# Altium project XRay.PrjPcb
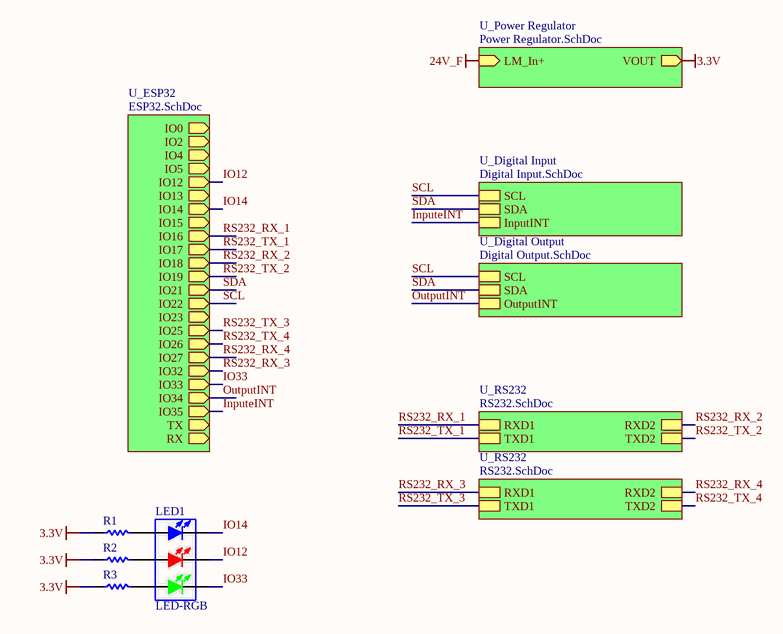
[diagram p0: Main.SchDoc]
6 sheets, 238 parts. Net scope: hierarchical (ports join the sheet entries above them; power ports are global).
Board file: XRay PCB.PcbDoc
Sheets:
  Main.SchDoc
    U_ESP32 = ESP32.SchDoc
    U_Power Regulator = Power Regulator.SchDoc
    U_Digital Output = Digital Output.SchDoc
    U_Digital Input = Digital Input.SchDoc
    U_RS232 = RS232.SchDoc
    U_RS232 = RS232.SchDoc

## Sheet Main.SchDoc
size A4; SheetNumber: 1; SheetTotal: 6

### Parts
LED1  LED-RGB  [LED 3535]
R1  1K  [R 0805]  (value not drawn)
R2  1K  [R 0805]  (value not drawn)
R3  1K  [R 0805]  (value not drawn)

### Sub-sheets
U_Digital Input = Digital Input.SchDoc: SCL, SDA, InputINT
U_Digital Output = Digital Output.SchDoc: SCL, SDA, OutputINT
U_ESP32 = ESP32.SchDoc: IO2 (out), IO4 (out), IO5 (out), IO12 (out), IO13 (out), IO14 (out), IO15 (out), IO16 (out), IO17 (out), IO18 (out), IO19 (out), IO21 (out), IO22 (out), IO23 (out), IO25 (out), IO26 (out), IO27 (out), IO32 (out), IO33 (out), IO34 (out), IO35 (out), IO0 (out), TX (out), RX (out)
U_Power Regulator = Power Regulator.SchDoc: LM_In+ (in), VOUT (out)
U_RS232 = RS232.SchDoc: TXD1, TXD2, RXD1, RXD2
U_RS232 = RS232.SchDoc: TXD1, TXD2, RXD1, RXD2

### Nets
3.3V: R1.1 R2.1 R3.1 ; sheet U_Power Regulator/VOUT  [project net LM_Out+]
InputeINT: sheet U_ESP32/IO35, sheet U_Digital Input/InputINT
IO12: LED1.5(RED_K) ; sheet U_ESP32/IO12
IO14: LED1.6(BULE_K) ; sheet U_ESP32/IO14
IO33: LED1.4(GREEN_K) ; sheet U_ESP32/IO33
OutputINT: sheet U_ESP32/IO34, sheet U_Digital Output/OutputINT
RS232_RX_1: sheet U_ESP32/IO16, sheet U_RS232/RXD1
RS232_RX_2: sheet U_ESP32/IO18, sheet U_RS232/RXD2
RS232_RX_3: sheet U_ESP32/IO32, sheet U_RS232/RXD1
RS232_RX_4: sheet U_ESP32/IO27, sheet U_RS232/RXD2
RS232_TX_1: sheet U_ESP32/IO17, sheet U_RS232/TXD1
RS232_TX_2: sheet U_ESP32/IO19, sheet U_RS232/TXD2
RS232_TX_3: sheet U_ESP32/IO25, sheet U_RS232/TXD1
RS232_TX_4: sheet U_ESP32/IO26, sheet U_RS232/TXD2
SCL: sheet U_ESP32/IO22, sheet U_Digital Output/SCL, sheet U_Digital Input/SCL
SDA: sheet U_ESP32/IO21, sheet U_Digital Output/SDA, sheet U_Digital Input/SDA
NetLED1_1: LED1.1(BULE_A) R1.2
NetLED1_2: LED1.2(RED_A) R2.2
NetLED1_3: LED1.3(GREEN_A) R3.2

### Library data of the parts
LED1 = LED-RGB: Three primary color LED; BOM名称: 三基色LED; 版权归属: 源创客; 学习资源: www.ooocke.com
R1-R3 = R: Chip resistor; 版权归属: 源创客; BOM名称: Chip resistor; 学习资源: www.ooocke.com

## Sheet ESP32.SchDoc
size A4; SheetNumber: 5; SheetTotal: 6
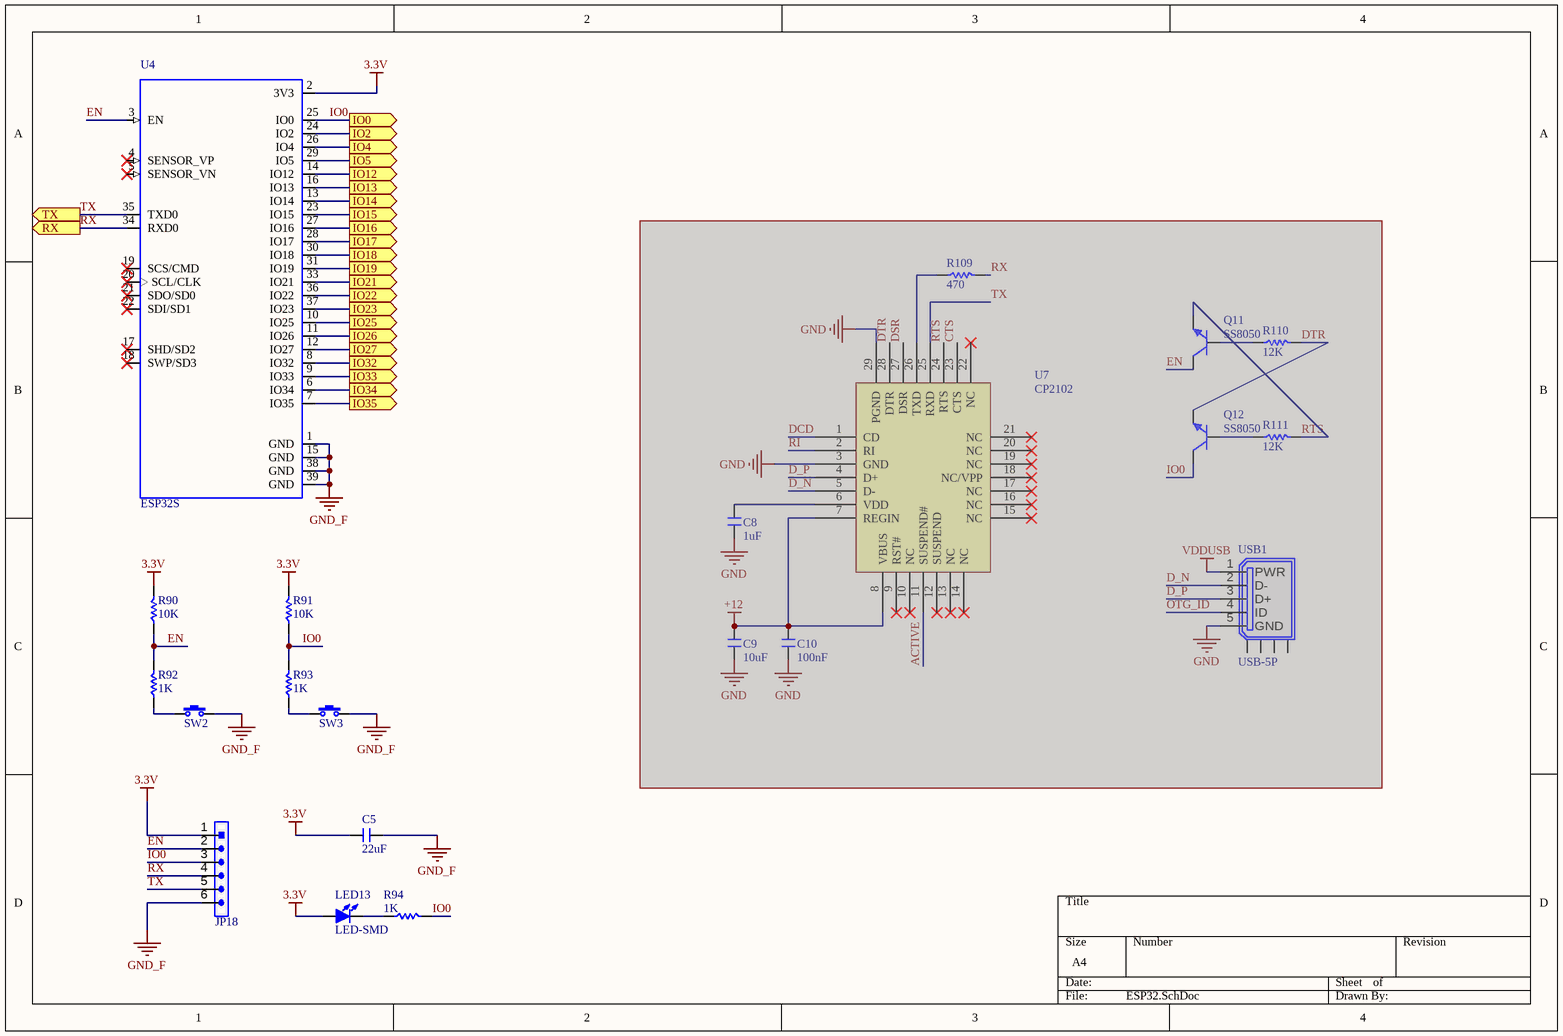
[diagram p1: ESP32.SchDoc]

### Parts
(Parts that share a designator on the sheet are numbered #1, #2 ... from top to bottom, then left to right.)
C5  22uF  [C 0805]
C8  1uF  [C 0805]  (masked out: inside a compile mask, not in the netlist)
C9  10uF  [C 0805]  (masked out: inside a compile mask, not in the netlist)
C10  100nF  [C 0805]  (masked out: inside a compile mask, not in the netlist)
JP18#1  HDR-1X6  [HDR-1X6]  (value not drawn)
LED13  LED-SMD  [LED 0805B]
Q11  SS8050  [SOT23-3N]  (masked out: inside a compile mask, not in the netlist)
Q12  SS8050  [SOT23-3N]  (masked out: inside a compile mask, not in the netlist)
R90  10K  [R 0805]
R91  10K  [R 0805]
R92  1K  [R 0805]
R93  1K  [R 0805]
R94  1K  [R 0805]
R109  470  [R 0805]  (masked out: inside a compile mask, not in the netlist)
R110  12K  [R 0805]  (masked out: inside a compile mask, not in the netlist)
R111  12K  [R 0805]  (masked out: inside a compile mask, not in the netlist)
SW2  3x6x5  [TSW SMD-3*6*2.5]  (value not drawn)
SW3  3x6x5  [TSW SMD-3*6*2.5]  (value not drawn)
U4  ESP32S  [ESP32S]
U7  CP2102  [QFN28]  (masked out: inside a compile mask, not in the netlist)
USB1  USB-5P  [USB-micro_B]  (masked out: inside a compile mask, not in the netlist)

### Ports
IO0 (out), IO2 (out), IO4 (out), IO5 (out), IO12 (out), IO13 (out), IO14 (out), IO15 (out), IO16 (out), IO17 (out), IO18 (out), IO19 (out), IO21 (out), IO22 (out), IO23 (out), IO25 (out), IO26 (out), IO27 (out), IO32 (out), IO33 (out), IO34 (out), IO35 (out), RX (out), TX (out)

### Nets
3.3V: C5.1 JP18#1.1 LED13.1(A) R90.2 R91.2 U4.2(3V3)  [project net LM_Out+]
GND_F: C5.2 JP18#1.6 SW2.2 SW3.2 U4.1(GND) U4.15(GND) U4.38(GND) U4.39(GND)
EN: JP18#1.2 R90.1 R92.2 U4.3(EN)
InputeINT: U4.7(IO35) ; port IO35
IO0: JP18#1.3 R91.1 R93.2 R94.2 U4.25(IO0) ; port IO0
IO12: U4.14(IO12) ; port IO12
IO14: U4.13(IO14) ; port IO14
IO33: U4.9(IO33) ; port IO33
OutputINT: U4.6(IO34) ; port IO34
RS232_RX_1: U4.27(IO16) ; port IO16
RS232_RX_2: U4.30(IO18) ; port IO18
RS232_RX_3: U4.8(IO32) ; port IO32
RS232_RX_4: U4.12(IO27) ; port IO27
RS232_TX_1: U4.28(IO17) ; port IO17
RS232_TX_2: U4.31(IO19) ; port IO19
RS232_TX_3: U4.10(IO25) ; port IO25
RS232_TX_4: U4.11(IO26) ; port IO26
RX: JP18#1.4 U4.34(RXD0) ; port RX
SCL: U4.36(IO22) ; port IO22
SDA: U4.33(IO21) ; port IO21
TX: JP18#1.5 U4.35(TXD0) ; port TX
NetLED13_2: LED13.2(K) R94.1
NetR92_1: R92.1 SW2.1
NetR93_1: R93.1 SW3.1
NetU4_16: U4.16(IO13) ; port IO13
NetU4_23: U4.23(IO15) ; port IO15
NetU4_24: U4.24(IO2) ; port IO2
NetU4_26: U4.26(IO4) ; port IO4
NetU4_29: U4.29(IO5) ; port IO5
NetU4_37: U4.37(IO23) ; port IO23

Not connected (* = marked no-connect by the designer): U4 4(SENSOR_VP)* 5(SENSOR_VN)* 17(SHD/SD2)* 18(SWP/SD3)* 19(SCS/CMD)* 20(SCL/CLK)* 21(SDO/SD0)* 22(SDI/SD1)*

### Library data of the parts
C5 C8-C10 = C: Non-polar patch capacitor; BOM名称: 无极性贴片电容; 版权归属: 源创客; 学习资源: www.ooocke.com
JP18#1 = Header 6: 6P Connector; BOM名称: 6P接插件; 版权归属: 源创客; 学习资源: www.ooocke.com
LED13 = LED-SMD: Patch LED; BOM名称: 贴片LED; 版权归属: 源创客; 学习资源: www.ooocke.com
Q11 Q12 = 8050-SMD: High frequency amplification-NPN; BOM名称: 高频放大-NPN型; 版权归属: 源创客; 属性: 40V 1.5A 1W 100MHZ; 学习资源: www.ooocke.com
R90-R94 R109-R111 = R: Chip resistor; 版权归属: 源创客; BOM名称: Chip resistor; 学习资源: www.ooocke.com
SW2 SW3 = TSW 3x6: 3x6 tact switch; BOM名称: 3x6轻触开关; 版权归属: 源创客; 学习资源: www.ooocke.com
U4 = ESP32S: MP: ESP32-WROOM-32D; MF: Espressif Systems; Package: Module Espressif Systems; Price: None; Availability: Unavailable; SnapEDA_Link: https://www.snapeda.com/parts/ESP32-WROOM-32D/Espressif%20Systems/view-part/?ref=snap; Value: *
U7 = CP2102: USB to USRT converter
USB1 = USB-5P: Micro & Mini USB female; BOM名称: 微型USB母座; 版权归属: 源创客; 学习资源: www.ooocke.com

## Sheet Power Regulator.SchDoc
size A4; SheetNumber: 2; SheetTotal: 6
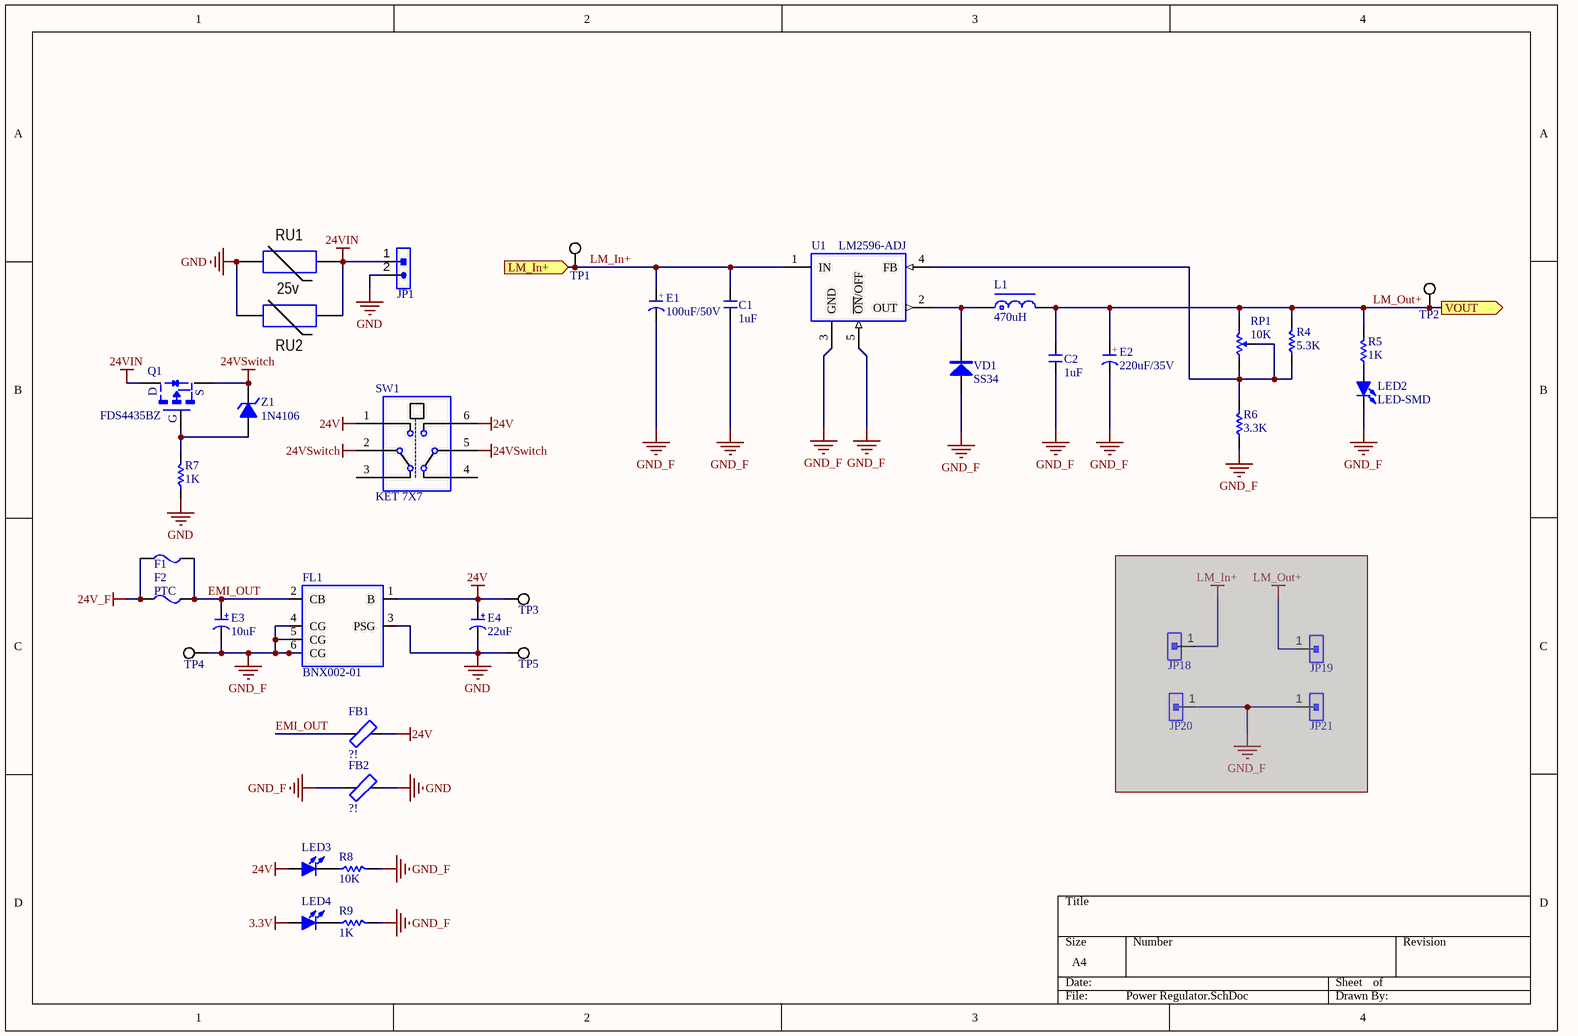
[diagram p2: Power Regulator.SchDoc]

### Parts
(Parts that share a designator on the sheet are numbered #1, #2 ... from top to bottom, then left to right.)
C1  1uF  [C 0805]
C2  1uF  [C 0805]
E1  100uF/50V  [CM E(8*10.2)]
E2  220uF/35V  [CM E(8*10.2)]
E3  10uF  [CM D(6.3*7.7)]
E4  22uF  [CM D(6.3*7.7)]
F1  PTC  [PTC]
F2  MSMD200-8V 2A  [FU 1206]  (value not drawn)
FB1  ?!  [F 1206]
FB2  ?!  [F 1206]
FL1  BNX002-01  [FIL_BNX002-01]
JP1  HDR-1X2  [KF2EDGK-2P_H_7.62]  (value not drawn)
JP18#2  HDR-1X1  [HDR-1X1]  (value not drawn)  (masked out: inside a compile mask, not in the netlist)
JP19  HDR-1X1  [HDR-1X1]  (value not drawn)  (masked out: inside a compile mask, not in the netlist)
JP20  HDR-1X1  [HDR-1X1]  (value not drawn)  (masked out: inside a compile mask, not in the netlist)
JP21  HDR-1X1  [HDR-1X1]  (value not drawn)  (masked out: inside a compile mask, not in the netlist)
L1  470uH  [CDRH127]
LED2  LED-SMD  [LED 0805R]
LED3  LED-SMD  [LED 0805R]  (value not drawn)
LED4  LED-SMD  [LED 0805R]  (value not drawn)
Q1  FDS4435BZ  [SOP8-E3]
R4  5.3K  [R 0805]
R5  1K  [R 0805]
R6  3.3K  [R 0805]
R7  1K  [R 0805]
R8  10K  [R 0805]
R9  1K  [R 0805]
RP1  10K  [3296W]
RU1  25v  [SMA]
RU2  *  [Varistor Short Hieght - Straight]  (value not drawn)
SW1  KET 7X7  [KFT DIP-7X7]
TP1  Test Point Pad  [TP15]  (value not drawn)
TP2  Test Point Pad  [TP15]  (value not drawn)
TP3  Test Point Pad  [TP15]  (value not drawn)
TP4  Test Point Pad  [TP15]  (value not drawn)
TP5  Test Point Pad  [TP15]  (value not drawn)
U1  LM2596-ADJ  [TO263-5A]
VD1  SS34  [SMA]
Z1  1N4106  [DO-213AA]

### Ports
LM_In+ (in), VOUT (out)

### Nets
24V: E4.1(A) FB1.2 FL1.1(B) LED3.1(A) SW1.1 SW1.6 TP3.1
24VIN: JP1.1 Q1.5-8(D) RU1.2 RU2.2
24VSwitch: Q1.1-3(S) SW1.2 SW1.5 Z1.2(K)
GND: E4.2(K) FB2.2 FL1.3(PSG) JP1.2 R7.1 RU1.1 RU2.1 TP5.1
GND_F: C1.1 C2.1 E1.2(K) E2.2(K) E3.2(K) FB2.1 FL1.4(CG) FL1.5(CG) FL1.6(CG) LED2.2(K) R6.1 R8.2 R9.2 TP4.1 U1.3(GND) U1.5(~{ON}/OFF) VD1.1(A)
LM_In+: C1.2 E1.1(A) F1.1 F2.1 TP1.1 U1.1(IN) ; port LM_In+  [also labelled 24V_F]
LM_Out+: C2.2 E2.1(A) L1.2 LED4.1(A) R4.2 R5.2 RP1.2 TP2.1 ; port VOUT  [also labelled 3.3V]
EMI_OUT: E3.1(A) F1.2 F2.2 FB1.1 FL1.2(CB)
NetL1_1: L1.1 U1.2(OUT) VD1.2(K)
NetLED2_1: LED2.1(A) R5.1
NetLED3_2: LED3.2(K) R8.1
NetLED4_2: LED4.2(K) R9.1
NetQ1_4: Q1.4(G) R7.2 Z1.1(A)
NetR4_1: R4.1 R6.2 RP1.1 RP1.ADJ U1.4(FB)

Not connected (* = marked no-connect by the designer): SW1 3 4

### Notes on the sheet
- (in symbol C-CM) +
- (in symbol KET 7X7) ---------------

### Library data of the parts
C1 C2 = C: as C5 on sheet ESP32; 学习资源: www.ooocke.com
E1-E4 = C-CM: Chip electrolytic capacitor; BOM名称: 贴片电解电容; 版权归属: 源创客; 学习资源: www.ooocke.com
F2 = FU: Chip fuse; BOM名称: 贴片保险丝; 版权归属: 源创客; 学习资源: www.ooocke.com
FB1 FB2 = FB: Ferrite Bead; BOM名称: 贴片电阻; 版权归属: 源创客; 学习资源: www.ooocke.com
FL1 = BNX002-01: LC EMI Filter 5th Order Low Pass 2 Channel 10A Block, 4 Lead; MF: Murata; Package: Block-4 Murata; Price: None; SnapEDA_Link: https://www.snapeda.com/parts/BNX002-01/Murata%20Electronics%20North%20America/view-part/12269/?ref=snap; Availability: Unavailable; Value: *; MP: BNX002-01
JP1 = Header 2: 2P Connector; BOM名称: 2P接插件; 版权归属: 源创客; 学习资源: www.ooocke.com
JP18#2 JP19-JP21 = Header 1: 1P Connector; BOM名称: 1P接插件; 版权归属: 源创客; 学习资源: www.ooocke.com
L1 = L-CDRH: Power shielded inductor; BOM名称: 功率屏蔽电感; 版权归属: 源创客; 学习资源: www.ooocke.com
LED2-LED4 = LED-SMD: Patch LED; BOM名称: 贴片LED; 版权归属: 源创客; 学习资源: www.ooocke.com
R4-R9 = R: Chip resistor; 版权归属: 源创客; BOM名称: Chip resistor; 学习资源: www.ooocke.com
RP1 = RP-THD: Plug-in potentiometer; BOM名称: 插件电位器; 版权归属: 源创客; 学习资源: www.ooocke.com
RU1 RU2 = V: Versiror; Manufacturer: *; Model: *; HelpURL: *; ComponentKind: *; Value: *
SW1 = KET 7X7: 7*7 switch; BOM名称: 7*7开关; 版权归属: 源创客; 学习资源: www.ooocke.com
TP1-TP5 = Test Point Pad: Company: SJ Libraries; Designer: Eng. Saeid Jorablo; Rule: UNIONINDEX=0|RULEKIND=ComponentClearance|NETSCOPE=AnyNet|LAYERKIND=SameLayer|NAME=Schematic Component Clearance Constraint|GAP=0mil|COLLISIONCHECKMODE=3|VERTICALGAP=0mil|SHOWDISTANCES=FALSE|UNIT=Imperial; Mounting Technology: Surface Mount\Through-Hole; ComponentLink1Description: Datasheet; Pin Count: 0; Update Date: 6/3/2012; Category: MISC; HelpURL: http://s3.picofile.com/file/7443264187/Coming_Soon_logo.gif
U1 = LM2596: DC step-down chip; BOM名称: DC稳压芯片; 版权归属: 源创客; 学习资源: www.ooocke.com
VD1 = SS34: Schottky diodes; BOM名称: 肖特基二极管; 版权归属: 源创客; 属性: 40V/3A; 学习资源: www.ooocke.com
Z1 = 1N4106: 12V/0.5W voltage regulator; BOM名称: 12V/0.5W稳压管; 版权归属: 源创客; 学习资源: www.ooocke.com

## Sheet Digital Output.SchDoc
size A4; SheetNumber: 4; SheetTotal: 6
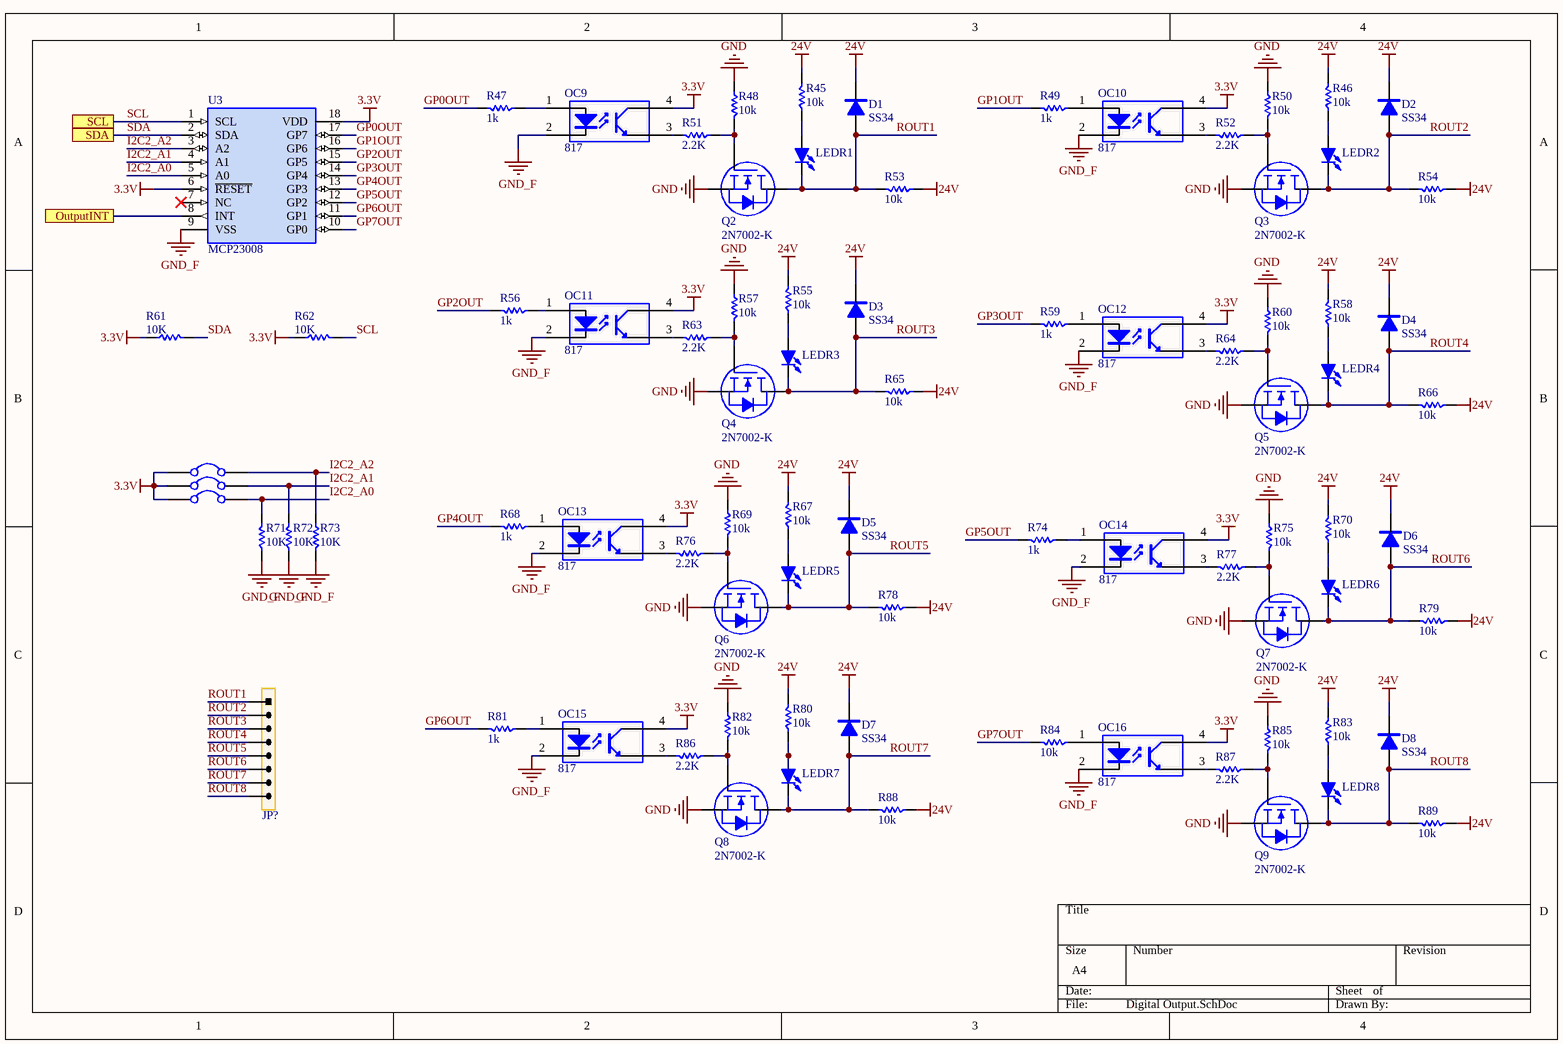
[diagram p3: Digital Output.SchDoc]

### Parts
(Parts that share a designator on the sheet are numbered #1, #2 ... from top to bottom, then left to right.)
D1  SS34  [SMA]
D2  SS34  [SMA]
D3  SS34  [SMA]
D4  SS34  [SMA]
D5  SS34  [SMA]
D6  SS34  [SMA]
D7  SS34  [SMA]
D8  SS34  [SMA]
JP?#1  HDR-1X8  [KF7620-8P]  (value not drawn)
LEDR1  LED-SMD  [LED 0805B]  (value not drawn)
LEDR2  LED-SMD  [LED 0805B]  (value not drawn)
LEDR3  LED-SMD  [LED 0805B]  (value not drawn)
LEDR4  LED-SMD  [LED 0805B]  (value not drawn)
LEDR5  LED-SMD  [LED 0805B]  (value not drawn)
LEDR6  LED-SMD  [LED 0805B]  (value not drawn)
LEDR7  LED-SMD  [LED 0805B]  (value not drawn)
LEDR8  LED-SMD  [LED 0805B]  (value not drawn)
OC9  817  [PC817-SMD]
OC10  817  [PC817-SMD]
OC11  817  [PC817-SMD]
OC12  817  [PC817-SMD]
OC13  817  [PC817-SMD]
OC14  817  [PC817-SMD]
OC15  817  [PC817-SMD]
OC16  817  [PC817-SMD]
Q2  2N7002-K  [SOT23-3L]
Q3  2N7002-K  [SOT23-3L]
Q4  2N7002-K  [SOT23-3L]
Q5  2N7002-K  [SOT23-3L]
Q6  2N7002-K  [SOT23-3L]
Q7  2N7002-K  [SOT23-3L]
Q8  2N7002-K  [SOT23-3L]
Q9  2N7002-K  [SOT23-3L]
R45  10k  [R 0805]
R46  10k  [R 0805]
R47  1k  [R 0805]
R48  10k  [R 0805]
R49  1k  [R 0805]
R50  10k  [R 0805]
R51  2.2K  [R 0805]
R52  2.2K  [R 0805]
R53  10k  [R 0805]
R54  10k  [R 0805]
R55  10k  [R 0805]
R56  1k  [R 0805]
R57  10k  [R 0805]
R58  10k  [R 0805]
R59  1k  [R 0805]
R60  10k  [R 0805]
R61  10K  [R 0805]
R62  10K  [R 0805]
R63  2.2K  [R 0805]
R64  2.2K  [R 0805]
R65  10k  [R 0805]
R66  10k  [R 0805]
R67  10k  [R 0805]
R68  1k  [R 0805]
R69  10k  [R 0805]
R70  10k  [R 0805]
R71  10K  [R 0805]
R72  10K  [R 0805]
R73  10K  [R 0805]
R74  1k  [R 0805]
R75  10k  [R 0805]
R76  2.2K  [R 0805]
R77  2.2K  [R 0805]
R78  10k  [R 0805]
R79  10k  [R 0805]
R80  10k  [R 0805]
R81  1k  [R 0805]
R82  10k  [R 0805]
R83  10k  [R 0805]
R84  10k  [R 0805]
R85  10k  [R 0805]
R86  2.2K  [R 0805]
R87  2.2K  [R 0805]
R88  10k  [R 0805]
R89  10k  [R 0805]
SB4  Solder Bridge  [Solder Bridge Open]  (value not drawn)
SB5  Solder Bridge  [Solder Bridge Open]  (value not drawn)
SB6  Solder Bridge  [Solder Bridge Open]  (value not drawn)
U3  MCP23008  [SOP18W_M]

### Ports
OutputINT, SCL, SDA

### Nets
3.3V: OC9.4(C) OC10.4(C) OC11.4(C) OC12.4(C) OC13.4(C) OC14.4(C) OC15.4(C) OC16.4(C) R61.1 R62.1 SB4.1 SB5.1 SB6.1 U3.6(~{RESET}) U3.18(VDD)  [project net LM_Out+]
24V: D1.2(K) D2.2(K) D3.2(K) D4.2(K) D5.2(K) D6.2(K) D7.2(K) D8.2(K) R45.2 R46.2 R53.1 R54.1 R55.2 R58.2 R65.1 R66.1 R67.2 R70.2 R78.1 R79.1 R80.2 R83.2 R88.1 R89.1
GND: Q2.2(S) Q3.2(S) Q4.2(S) Q5.2(S) Q6.2(S) Q7.2(S) Q8.2(S) Q9.2(S) R48.1 R50.1 R57.1 R60.1 R69.1 R75.1 R82.1 R85.1
GND_F: OC9.2(K) OC10.2(K) OC11.2(K) OC12.2(K) OC13.2(K) OC14.2(K) OC15.2(K) OC16.2(K) R71.1 R72.1 R73.2 U3.9(VSS)
GP0OUT: R47.2 U3.17(GP7)
GP1OUT: R49.2 U3.16(GP6)
GP2OUT: R56.2 U3.15(GP5)
GP3OUT: R59.2 U3.14(GP4)
GP4OUT: R68.2 U3.13(GP3)
GP5OUT: R74.2 U3.12(GP2)
GP6OUT: R81.2 U3.11(GP1)
GP7OUT: R84.2 U3.10(GP0)
I2C2_A0: R71.2 SB6.2 U3.5(A0)
I2C2_A1: R72.2 SB5.2 U3.4(A1)
I2C2_A2: R73.1 SB4.2 U3.3(A2)
OutputINT: U3.8(INT) ; port OutputINT
ROUT1: D1.1(A) JP?#1.1 LEDR1.2(K) Q2.3(D) R53.2
ROUT2: D2.1(A) JP?#1.2 LEDR2.2(K) Q3.3(D) R54.2
ROUT3: D3.1(A) JP?#1.3 LEDR3.2(K) Q4.3(D) R65.2
ROUT4: D4.1(A) JP?#1.4 LEDR4.2(K) Q5.3(D) R66.2
ROUT5: D5.1(A) JP?#1.5 LEDR5.2(K) Q6.3(D) R78.2
ROUT6: D6.1(A) JP?#1.6 LEDR6.2(K) Q7.3(D) R79.2
ROUT7: D7.1(A) JP?#1.7 LEDR7.2(K) Q8.3(D) R88.2
ROUT8: D8.1(A) JP?#1.8 LEDR8.2(K) Q9.3(D) R89.2
SCL: R62.2 U3.1(SCL) ; port SCL
SDA: R61.2 U3.2(SDA) ; port SDA
NetLEDR1_1: LEDR1.1(A) R45.1
NetLEDR2_1: LEDR2.1(A) R46.1
NetLEDR3_1: LEDR3.1(A) R55.1
NetLEDR4_1: LEDR4.1(A) R58.1
NetLEDR5_1: LEDR5.1(A) R67.1
NetLEDR6_1: LEDR6.1(A) R70.1
NetLEDR7_1: LEDR7.1(A) R80.1
NetLEDR8_1: LEDR8.1(A) R83.1
NetOC9_1: OC9.1(A) R47.1
NetOC9_3: OC9.3(E) R51.2
NetOC10_1: OC10.1(A) R49.1
NetOC10_3: OC10.3(E) R52.2
NetOC11_1: OC11.1(A) R56.1
NetOC11_3: OC11.3(E) R63.2
NetOC12_1: OC12.1(A) R59.1
NetOC12_3: OC12.3(E) R64.2
NetOC13_1: OC13.1(A) R68.1
NetOC13_3: OC13.3(E) R76.2
NetOC14_1: OC14.1(A) R74.1
NetOC14_3: OC14.3(E) R77.2
NetOC15_1: OC15.1(A) R81.1
NetOC15_3: OC15.3(E) R86.2
NetOC16_1: OC16.1(A) R84.1
NetOC16_3: OC16.3(E) R87.2
NetQ2_1: Q2.1(G) R48.2 R51.1
NetQ3_1: Q3.1(G) R50.2 R52.1
NetQ4_1: Q4.1(G) R57.2 R63.1
NetQ5_1: Q5.1(G) R60.2 R64.1
NetQ6_1: Q6.1(G) R69.2 R76.1
NetQ7_1: Q7.1(G) R75.2 R77.1
NetQ8_1: Q8.1(G) R82.2 R86.1
NetQ9_1: Q9.1(G) R85.2 R87.1

Not connected (* = marked no-connect by the designer): U3 7(NC)*

### Library data of the parts
D1-D8 = M7: Rectifier diode; BOM名称: 整流二极管; 版权归属: 源创客; 学习资源: www.ooocke.com
JP?#1 = Header 8: 8P Connector; BOM名称: 8P接插件; 版权归属: 源创客; 学习资源: www.ooocke.com
LEDR1-LEDR8 = LED-SMD: Patch LED; BOM名称: 贴片LED; 版权归属: 源创客; 学习资源: www.ooocke.com
OC9-OC16 = 817: AC Input Photocoupler; BOM名称: 线性光耦; 版权归属: 源创客; 学习资源: www.ooocke.com
Q2-Q9 = 2N7002-SMD: N-Channel Enhancement Mode Field Effect Transistor
R45-R89 = R: Chip resistor; 版权归属: 源创客; BOM名称: Chip resistor; 学习资源: www.ooocke.com
U3 = MCP23008: 8 Bit I/O Expander

## Sheet Digital Input.SchDoc
size A4; SheetNumber: 3; SheetTotal: 6
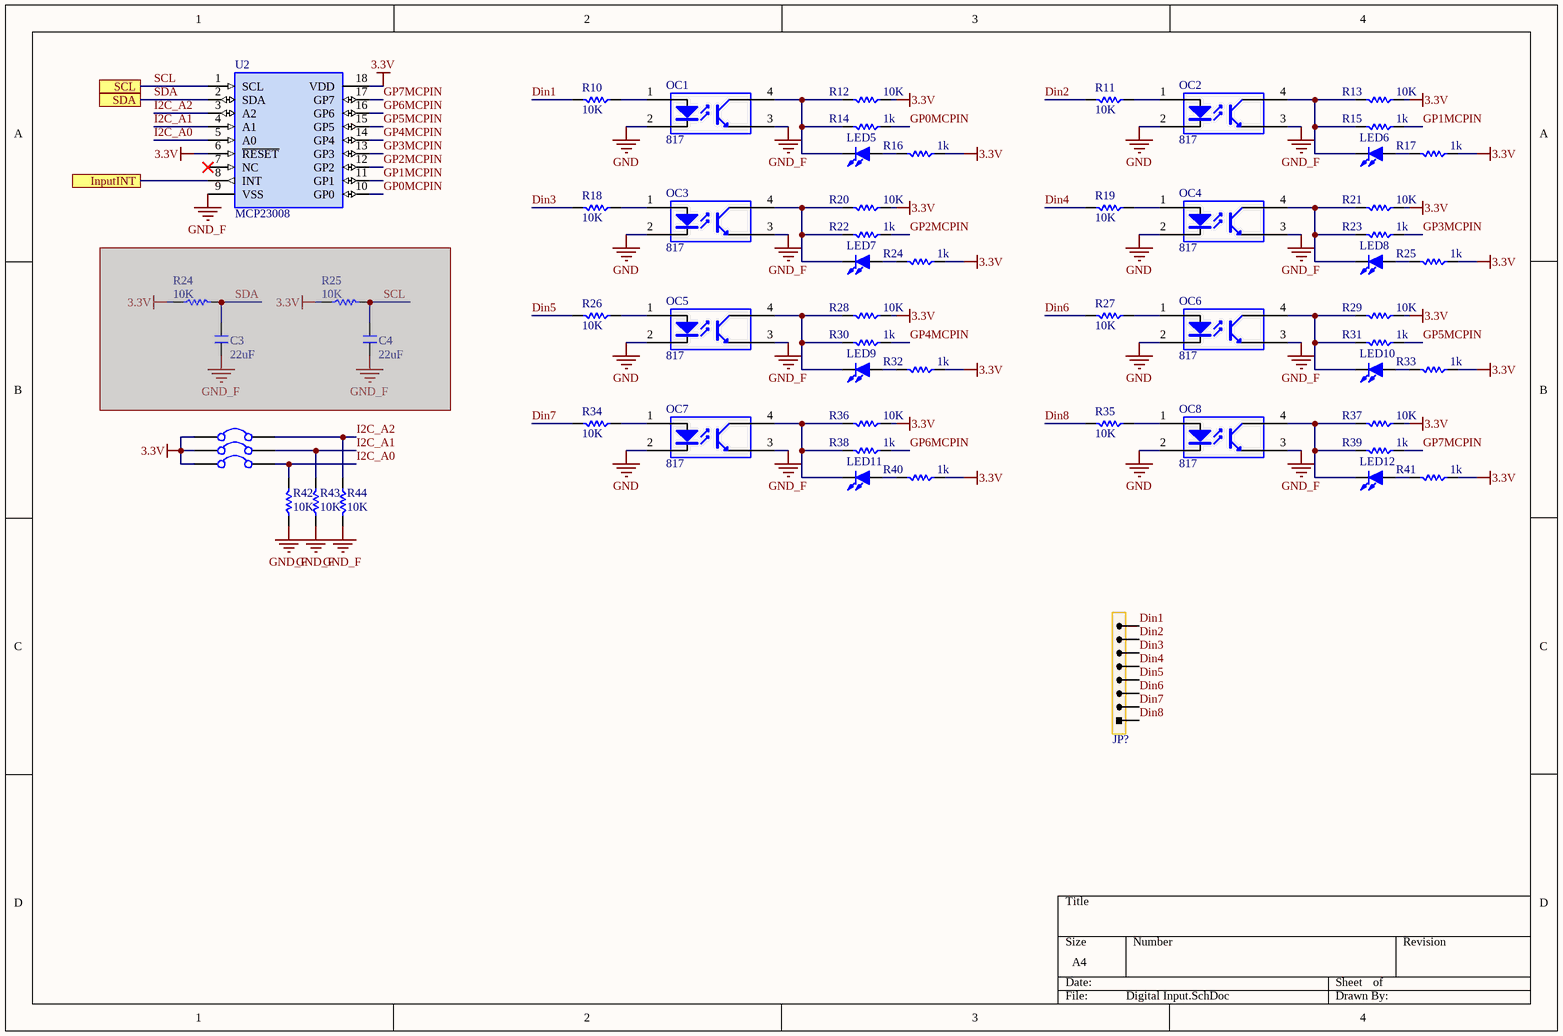
[diagram p4: Digital Input.SchDoc]

### Parts
(Parts that share a designator on the sheet are numbered #1, #2 ... from top to bottom, then left to right.)
C3  22uF  [C 0805]  (masked out: inside a compile mask, not in the netlist)
C4  22uF  [C 0805]  (masked out: inside a compile mask, not in the netlist)
JP?#2  HDR-1X8  [KF7620-8P]  (value not drawn)
LED5  LED-SMD  [LED 0805B]  (value not drawn)
LED6  LED-SMD  [LED 0805B]  (value not drawn)
LED7  LED-SMD  [LED 0805B]  (value not drawn)
LED8  LED-SMD  [LED 0805B]  (value not drawn)
LED9  LED-SMD  [LED 0805B]  (value not drawn)
LED10  LED-SMD  [LED 0805B]  (value not drawn)
LED11  LED-SMD  [LED 0805B]  (value not drawn)
LED12  LED-SMD  [LED 0805B]  (value not drawn)
OC1  817  [PC817-SMD]
OC2  817  [PC817-SMD]
OC3  817  [PC817-SMD]
OC4  817  [PC817-SMD]
OC5  817  [PC817-SMD]
OC6  817  [PC817-SMD]
OC7  817  [PC817-SMD]
OC8  817  [PC817-SMD]
R10  10K  [R 0805]
R11  10K  [R 0805]
R12  10K  [R 0805]
R13  10K  [R 0805]
R14  1k  [R 0805]
R15  1k  [R 0805]
R16  1k  [R 0805]
R17  1k  [R 0805]
R18  10K  [R 0805]
R19  10K  [R 0805]
R20  10K  [R 0805]
R21  10K  [R 0805]
R22  1k  [R 0805]
R23  1k  [R 0805]
R24#1  1k  [R 0805]
R24#2  10K  [R 0805]  (masked out: inside a compile mask, not in the netlist)
R25#1  1k  [R 0805]
R25#2  10K  [R 0805]  (masked out: inside a compile mask, not in the netlist)
R26  10K  [R 0805]
R27  10K  [R 0805]
R28  10K  [R 0805]
R29  10K  [R 0805]
R30  1k  [R 0805]
R31  1k  [R 0805]
R32  1k  [R 0805]
R33  1k  [R 0805]
R34  10K  [R 0805]
R35  10K  [R 0805]
R36  10K  [R 0805]
R37  10K  [R 0805]
R38  1k  [R 0805]
R39  1k  [R 0805]
R40  1k  [R 0805]
R41  1k  [R 0805]
R42  10K  [R 0805]
R43  10K  [R 0805]
R44  10K  [R 0805]
SB1  Solder Bridge  [Solder Bridge Open]  (value not drawn)
SB2  Solder Bridge  [Solder Bridge Open]  (value not drawn)
SB3  Solder Bridge  [Solder Bridge Open]  (value not drawn)
U2  MCP23008  [SOP18W_M]

### Ports
InputINT, SCL, SDA

### Nets
3.3V: R12.1 R13.1 R16.1 R17.1 R20.1 R21.1 R24#1.1 R25#1.1 R28.1 R29.1 R32.1 R33.1 R36.1 R37.1 R40.1 R41.1 SB1.1 SB2.1 SB3.1 U2.6(~{RESET}) U2.18(VDD)  [project net LM_Out+]
GND: OC1.2(K) OC2.2(K) OC3.2(K) OC4.2(K) OC5.2(K) OC6.2(K) OC7.2(K) OC8.2(K)
GND_F: OC1.3(E) OC2.3(E) OC3.3(E) OC4.3(E) OC5.3(E) OC6.3(E) OC7.3(E) OC8.3(E) R42.1 R43.1 R44.2 U2.9(VSS)
Din1: JP?#2.8 R10.2
Din2: JP?#2.7 R11.2
Din3: JP?#2.6 R18.2
Din4: JP?#2.5 R19.2
Din5: JP?#2.4 R26.2
Din6: JP?#2.3 R27.2
Din7: JP?#2.2 R34.2
Din8: JP?#2.1 R35.2
GP0MCPIN: R14.1 U2.10(GP0)
GP1MCPIN: R15.1 U2.11(GP1)
GP2MCPIN: R22.1 U2.12(GP2)
GP3MCPIN: R23.1 U2.13(GP3)
GP4MCPIN: R30.1 U2.14(GP4)
GP5MCPIN: R31.1 U2.15(GP5)
GP6MCPIN: R38.1 U2.16(GP6)
GP7MCPIN: R39.1 U2.17(GP7)
I2C_A0: R42.2 SB3.2 U2.5(A0)
I2C_A1: R43.2 SB2.2 U2.4(A1)
I2C_A2: R44.1 SB1.2 U2.3(A2)
InputeINT: U2.8(INT) ; port InputINT
SCL: U2.1(SCL) ; port SCL
SDA: U2.2(SDA) ; port SDA
NetLED5_1: LED5.1(A) R16.2
NetLED5_2: LED5.2(K) OC1.4(C) R12.2 R14.2
NetLED6_1: LED6.1(A) R17.2
NetLED6_2: LED6.2(K) OC2.4(C) R13.2 R15.2
NetLED7_1: LED7.1(A) R24#1.2
NetLED7_2: LED7.2(K) OC3.4(C) R20.2 R22.2
NetLED8_1: LED8.1(A) R25#1.2
NetLED8_2: LED8.2(K) OC4.4(C) R21.2 R23.2
NetLED9_1: LED9.1(A) R32.2
NetLED9_2: LED9.2(K) OC5.4(C) R28.2 R30.2
NetLED10_1: LED10.1(A) R33.2
NetLED10_2: LED10.2(K) OC6.4(C) R29.2 R31.2
NetLED11_1: LED11.1(A) R40.2
NetLED11_2: LED11.2(K) OC7.4(C) R36.2 R38.2
NetLED12_1: LED12.1(A) R41.2
NetLED12_2: LED12.2(K) OC8.4(C) R37.2 R39.2
NetOC1_1: OC1.1(A) R10.1
NetOC2_1: OC2.1(A) R11.1
NetOC3_1: OC3.1(A) R18.1
NetOC4_1: OC4.1(A) R19.1
NetOC5_1: OC5.1(A) R26.1
NetOC6_1: OC6.1(A) R27.1
NetOC7_1: OC7.1(A) R34.1
NetOC8_1: OC8.1(A) R35.1

Not connected (* = marked no-connect by the designer): U2 7(NC)*

### Library data of the parts
C3 C4 = C: as C5 on sheet ESP32; 学习资源: www.ooocke.com
JP?#2 = Header 8: 8P Connector; BOM名称: 8P接插件; 版权归属: 源创客; 学习资源: www.ooocke.com
LED5-LED12 = LED-SMD: Patch LED; BOM名称: 贴片LED; 版权归属: 源创客; 学习资源: www.ooocke.com
OC1-OC8 = 817: as OC9 on sheet Digital Output; 学习资源: www.ooocke.com
R10-R23 R24#1 R24#2 R25#1 R25#2 R26-R44 = R: Chip resistor; 版权归属: 源创客; BOM名称: Chip resistor; 学习资源: www.ooocke.com
U2 = MCP23008: 8 Bit I/O Expander

## Sheet RS232.SchDoc
size A4; SheetNumber: 6; SheetTotal: 6
Used 2 times, as channels U_RS232, U_RS232. Parts and nets are listed once, with the designators drawn on the sheet.
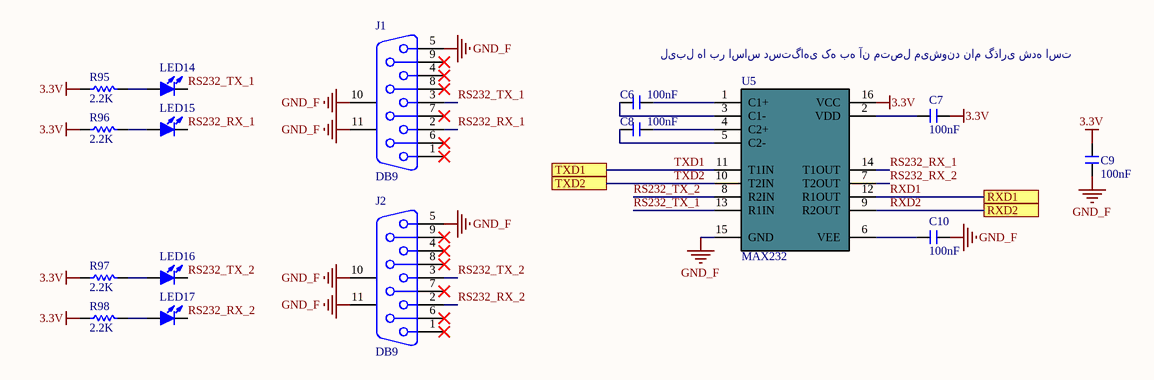
[diagram p5: RS232.SchDoc]

### Parts
C6  100nF  [C 0805]
C7  100nF  [C 0805]
C8  100nF  [C 0805]
C9  100nF  [C 0805]
C10  100nF  [C 0805]
J1  DB9  [DB9/S_A]
J2  DB9  [DB9/S_A]
LED14  LED-SMD  [LED 0805Y]  (value not drawn)
LED15  LED-SMD  [LED 0805Y]  (value not drawn)
LED16  LED-SMD  [LED 0805Y]  (value not drawn)
LED17  LED-SMD  [LED 0805Y]  (value not drawn)
R95  2.2K  [R 0805]
R96  2.2K  [R 0805]
R97  2.2K  [R 0805]
R98  2.2K  [R 0805]
U5  MAX232  [SOP16_N]

### Ports
RXD1, RXD2, TXD1, TXD2

### Nets
3.3V: C7.2 C9.1 R95.1 R96.1 R97.1 R98.1 U5.16(VCC)
GND_F: C9.2 C10.2 J1.5 J1.10(MH1) J1.11(MH2) J2.5 J2.10(MH1) J2.11(MH2) U5.15(GND)
RS232_RX_1: J1.2 LED15.2(K) U5.14(T1OUT)
RS232_RX_2: J2.2 LED17.2(K) U5.7(T2OUT)
RS232_TX_1: J1.3 LED14.2(K) U5.13(R1IN)
RS232_TX_2: J2.3 LED16.2(K) U5.8(R2IN)
RXD1: U5.12(R1OUT) ; port RXD1
RXD2: U5.9(R2OUT) ; port RXD2
TXD1: U5.11(T1IN) ; port TXD1
TXD2: U5.10(T2IN) ; port TXD2
NetC6_1: C6.1 U5.3(C1-)
NetC6_2: C6.2 U5.1(C1+)
NetC7_1: C7.1 U5.2(VDD)
NetC8_1: C8.1 U5.4(C2+)
NetC8_2: C8.2 U5.5(C2-)
NetC10_1: C10.1 U5.6(VEE)
NetLED14_1: LED14.1(A) R95.2
NetLED15_1: LED15.1(A) R96.2
NetLED16_1: LED16.1(A) R97.2
NetLED17_1: LED17.1(A) R98.2

Not connected (* = marked no-connect by the designer): J1 1* 4* 6* 7* 8* 9*; J2 1* 4* 6* 7* 8* 9*

### Channels
U_RS232: designators end in _U_RS232#1; ports RXD1=RS232_RX_1 RXD2=RS232_RX_2 TXD1=RS232_TX_1 TXD2=RS232_TX_2
U_RS232: designators end in _U_RS232#2; ports RXD1=RS232_RX_3 RXD2=RS232_RX_4 TXD1=RS232_TX_3 TXD2=RS232_TX_4

### Notes on the sheet
- لیبل ها بر اساس دستگاهی که به آن متصل میشوند نام گذاری شده است

### Library data of the parts
C6-C10 = C: as C5 on sheet ESP32; 学习资源: www.ooocke.com
J1 J2 = DB9: 9-pin serial port; BOM名称: 9针串口; 版权归属: 源创客; 学习资源: www.ooocke.com
LED14-LED17 = LED-SMD: Patch LED; BOM名称: 贴片LED; 版权归属: 源创客; 学习资源: www.ooocke.com
R95-R98 = R: Chip resistor; 版权归属: 源创客; BOM名称: Chip resistor; 学习资源: www.ooocke.com
U5 = MAX232: RS432 to USB; 版权归属: 源创客; BOM名称: MAX232; 学习资源: www.ooocke.com

## Nets that join several sheets
24V: Power Regulator (7 pins), Digital Output (24 pins)
GND: Power Regulator (8 pins), Digital Output (16 pins), Digital Input (8 pins)
GND_F: ESP32 (8 pins), Power Regulator (17 pins), Digital Output (12 pins), Digital Input (12 pins), U_RS232 (9 pins), U_RS232 (9 pins)
LM_Out+: Main (R1.1 R2.1 R3.1), ESP32 (6 pins), Power Regulator (8 pins), Digital Output (15 pins), Digital Input (21 pins), U_RS232 (7 pins), U_RS232 (7 pins)
InputeINT: ESP32 (U4.7), Digital Input (U2.8)
IO12: Main (LED1.5), ESP32 (U4.14)
IO14: Main (LED1.6), ESP32 (U4.13)
IO33: Main (LED1.4), ESP32 (U4.9)
OutputINT: ESP32 (U4.6), Digital Output (U3.8)
RS232_RX_1: ESP32 (U4.27), U_RS232 (U5_U_RS232#1.12)
RS232_RX_2: ESP32 (U4.30), U_RS232 (U5_U_RS232#1.9)
RS232_RX_3: ESP32 (U4.8), U_RS232 (U5_U_RS232#2.12)
RS232_RX_4: ESP32 (U4.12), U_RS232 (U5_U_RS232#2.9)
RS232_TX_1: ESP32 (U4.28), U_RS232 (U5_U_RS232#1.11)
RS232_TX_2: ESP32 (U4.31), U_RS232 (U5_U_RS232#1.10)
RS232_TX_3: ESP32 (U4.10), U_RS232 (U5_U_RS232#2.11)
RS232_TX_4: ESP32 (U4.11), U_RS232 (U5_U_RS232#2.10)
SCL: ESP32 (U4.36), Digital Output (R62.2 U3.1), Digital Input (U2.1)
SDA: ESP32 (U4.33), Digital Output (R61.2 U3.2), Digital Input (U2.2)